# Altium project task9_Project_1.PrjPcb
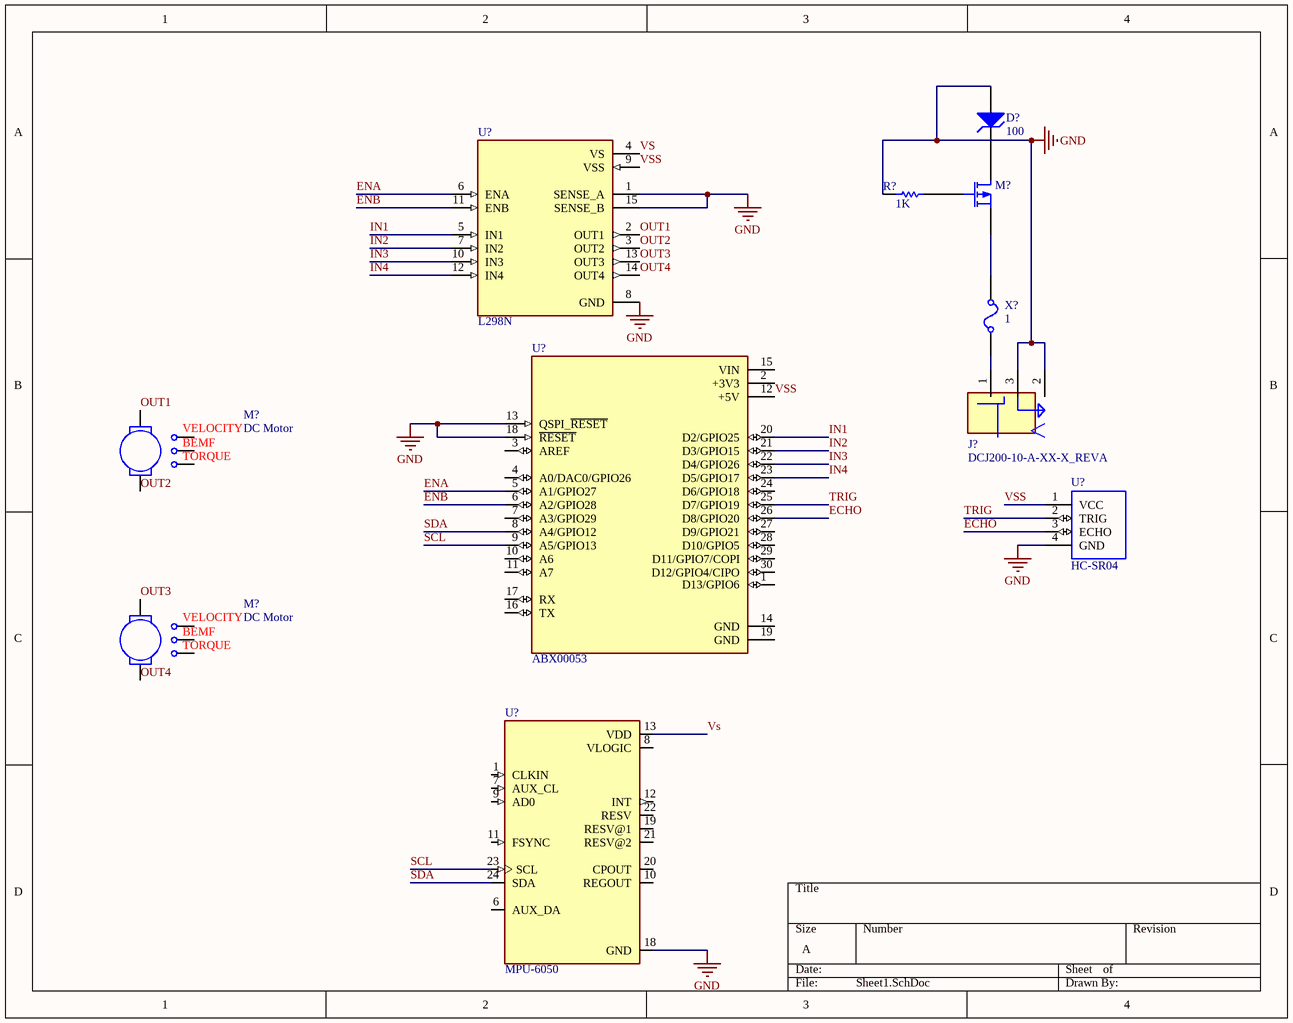
[diagram p0: Sheet1.SchDoc]
1 sheet, 11 parts. Net scope: global (net labels, ports and power ports of the same name join across sheets).
Board file: PCB1.PcbDoc

## Sheet Sheet1.SchDoc
size A; SheetNumber: 1; SheetTotal: 1

### Parts
(Parts that share a designator on the sheet are numbered #1, #2 ... from top to bottom, then left to right.)
D?  BV: 100  (hidden comment: Zener Diode)
J?  DCJ200-10-A-XX-X_REVA  [GCT_DCJ200-10-A-XX-X_REVA]
M?#1  P-chanel Power MOSFET VDMOS Model  (value not drawn)
M?#2  DC Motor
M?#3  DC Motor
R?  value 1K  (hidden comment: Resistor)
U?#1  L298N  [TO127P2020X500X2100-15]
U?#2  ABX00053  [MODULE_ABX00053]
U?#3  HC-SR04  [XCVR_HC-SR04]
U?#4  MPU-6050  [QFN50P400X400X95-24N]
X?  CURRENT: 1  (hidden comment: Fuse)

### Nets
GND: D?.1(A) J?.2 J?.3 R?.1 U?#1.1(SENSE_A) U?#1.8(GND) U?#1.15(SENSE_B) U?#2.13(QSPI_~{RESET}) U?#2.18(~{RESET}) U?#3.4(GND) U?#4.18(GND)
ECHO: U?#2.26(D8/GPIO20) U?#3.3(ECHO)
ENA: U?#1.6(ENA) U?#2.5(A1/GPIO27)
ENB: U?#1.11(ENB) U?#2.6(A2/GPIO28)
IN1: U?#1.5(IN1) U?#2.20(D2/GPIO25)
IN2: U?#1.7(IN2) U?#2.21(D3/GPIO15)
IN3: U?#1.10(IN3) U?#2.22(D4/GPIO26)
IN4: U?#1.12(IN4) U?#2.23(D5/GPIO17)
OUT1: M?#2.1 U?#1.2(OUT1)
OUT2: M?#2.2 U?#1.3(OUT2)
OUT3: M?#3.1 U?#1.13(OUT3)
OUT4: M?#3.2 U?#1.14(OUT4)
SCL: U?#2.9(A5/GPIO13) U?#4.23(SCL)
SDA: U?#2.8(A4/GPIO12) U?#4.24(SDA)
TRIG: U?#2.25(D7/GPIO19) U?#3.2(TRIG)
VS: U?#1.4(VS) U?#4.13(VDD)
VSS: U?#1.9(VSS) U?#2.12(+5V) U?#3.1(VCC)
NetD?_2: D?.2(K) M?#1.1(D)
NetJ?_1: J?.1 X?.1
NetM?#1_2: M?#1.2(G) R?.2
NetM?#1_3: M?#1.3(S) X?.2

Not connected (* = marked no-connect by the designer): M?#2 3 4 5; M?#3 3 4 5; U?#2 1(D13/GPIO6) 2(+3V3) 3(AREF) 4(A0/DAC0/GPIO26) 7(A3/GPIO29) 10(A6) 11(A7) 14(GND) 15(VIN) 16(TX) 17(RX) 19(GND) 24(D6/GPIO18) 27(D9/GPIO21) 28(D10/GPIO5) 29(D11/GPIO7/COPI) 30(D12/GPIO4/CIPO); U?#4 1(CLKIN) 6(AUX_DA) 7(AUX_CL) 8(VLOGIC) 9(AD0) 10(REGOUT) 11(FSYNC) 12(INT) 19(RESV@1) 20(CPOUT) 21(RESV@2) 22(RESV)

### Notes on the sheet
- (in symbol DC Motor) VELOCITY; BEMF; TORQUE

### Library data of the parts
D? = Zener Diode: AF: 1; BV_MAX: 1e99; CJO: 0; EG: 1.11; FC: 0.5; IBV: 0.001; IS: 1e-14; MJSW: 0.33; NTUN: 30; TNOM: 27; XTI: 3; SimulationGenericComponent: True; CJP: 0; CTA: 0; CTP: 0; FCS: 0.5; FV_MAX: 1e99; IKF: 0; IKR: 0; ISR: 1e-14; JSW: 0; JTUN: 0; JTUNSW: 0; KEG: 1; KF: 0; LEVEL: 1; N: 1; NBV: 1; NR: 1; NS: 1; PHP: 1; RS: 0; TCV: 0; TLEV: 0; TLEVC: 0; TM1: 0; TM2: 0; TPB: 0; TPHP: 0; TRS: 0; TRS2: 0; TT: 0; TTT1: 0; TTT2: 0; VJ: 1; XTITUN: 3
J? = DCJ200-10-A-XX-X_REVA: Power Barrel Connector Jack 2.05mm ID (0.081"), 5.50mm OD (0.217") Through Hole, Right Angle; MF: Global Connector Technology; MP: DCJ200-10-A-K1-K; Package: None; Price: None; Availability: Unavailable; Check_prices: https://www.snapeda.com/parts/DCJ200-10-A-K1-K/Global+Connector+Technology/view-part/?ref=eda; SnapEDA_Link: https://www.snapeda.com/parts/DCJ200-10-A-K1-K/Global+Connector+Technology/view-part/?ref=snap; Value: *
M?#1 = MOSFET P-ch VDMOS: XTI: 0; A: 1; BV: 1e30; EG: 1.11; FC: 0.5; IBV: 1e-10; IS: 1e-14; PHI: 0.6; TNOM: 27; VJ: 0.8; SimulationGenericComponent: True; CGDMAX: 0; CGDMIN: 0; CGS: 0; CJO: 0; KP: 1; KSUBTHRES: 0; LAMBDA: 0; M: 0.5; MTRIODE: 1; N: 1; NBV: 1; NCHAN: 1; PCHAN: 1; RB: 0; RD: 0; RDS: 1e30; RG: 0; RQ: 0; RS: 0; SUBSHIFT: 0; SUBSLOPE: 0; THETA: 0; TT: 0; VQ: 0; VTO: 0
M?#2 M?#3 = DC Motor: LA: 1.5M; RA: 0.5; KE: 0.05; JM: 250U; BM: 0.1M; TL: 0; SimulationGenericComponent: True; KT: 0.05
R? = Resistor: TC1: 0; SimulationGenericComponent: True; TC2: 0
U?#1 = L298N: Dual Full Bridge Motor Driver 15-Pin(15+Tab) MULTIWATT V Tube; MP: L298N; Availability: Unavailable; Package: None; Value: *; Price: None
U?#2 = ABX00053: NINA-W102, RP2040 Arduino Nano RP2040 Connect with Headers series ARMÂ® CortexÂ®-M0+ MCU 32-Bit Embedded Evaluation Board; Value: *; SnapEDA_Link: https://www.snapeda.com/parts/ABX00053/Arduino/view-part/?ref=snap; MF: Arduino; Purchase-URL: https://pricing.snapeda.com/search/part/ABX00053/?ref=eda; Check_prices: https://www.snapeda.com/parts/ABX00053/Arduino/view-part/?ref=eda; Digi-Key_Part_Number: 1050-ABX00053-ND; Package: None; MP: ABX00053
U?#3 = HC-SR04: Ultrasonic Sensor Module; Availability: Unavailable; MP: HC-SR04; Value: *; Price: None; Package: None
U?#4 = MPU-6050: MPU-6050 series Accelerometer, Gyroscope, 3 Axis Sensor Evaluation Board; MF: TDK InvenSense; Value: *; SnapEDA_Link: https://www.snapeda.com/parts/MPU-6050/TDK+InvenSense/view-part/?ref=snap; Purchase-URL: https://pricing.snapeda.com/search/part/MPU-6050/?ref=eda; Availability: In Stock; Price: None; Package: QFN-24 InvenSense; Check_prices: https://www.snapeda.com/parts/MPU-6050/TDK+InvenSense/view-part/?ref=eda; MP: MPU-6050
X? = Fuse: RESISTANCE: 1m; SimulationGenericComponent: True